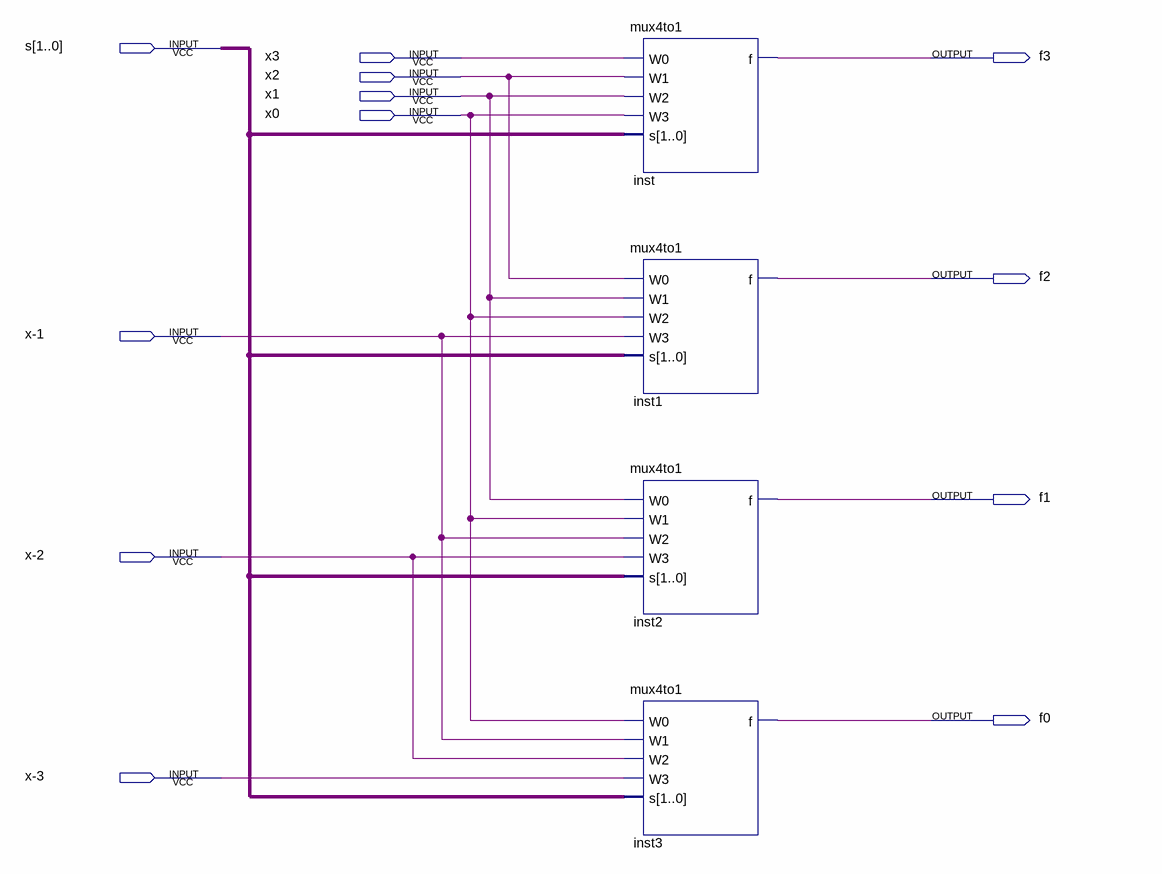
[diagram p0: schematic sheet]
// Quartus schematic lab8step2.bdf as structural Verilog: 4 symbols, 12 pins
module lab8step2 (
  input  [1:0] s,
  input  x3,
  input  x2,
  input  x1,
  input  x0,
  input  \x-1 ,
  input  \x-2 ,
  input  \x-3 ,
  output f3,
  output f2,
  output f1,
  output f0
);

  mux4to1 inst (.W0(x3), .W1(x2), .W2(x1), .W3(x0), .s(s), .f(f3));
  mux4to1 inst1 (.W0(x2), .W1(x1), .W2(x0), .W3(\x-1 ), .s(s), .f(f2));
  mux4to1 inst2 (.W0(x1), .W1(x0), .W2(\x-1 ), .W3(\x-2 ), .s(s), .f(f1));
  mux4to1 inst3 (.W0(x0), .W1(\x-1 ), .W2(\x-2 ), .W3(\x-3 ), .s(s), .f(f0));
endmodule
